# Altium schematic sheet Morpheus_middle.SchDoc: Morpheus_middle
size Letter; DrawnBy: D. Fusi; DocumentNumber: 2; Revision: DVT; SheetNumber: 2; SheetTotal: 7
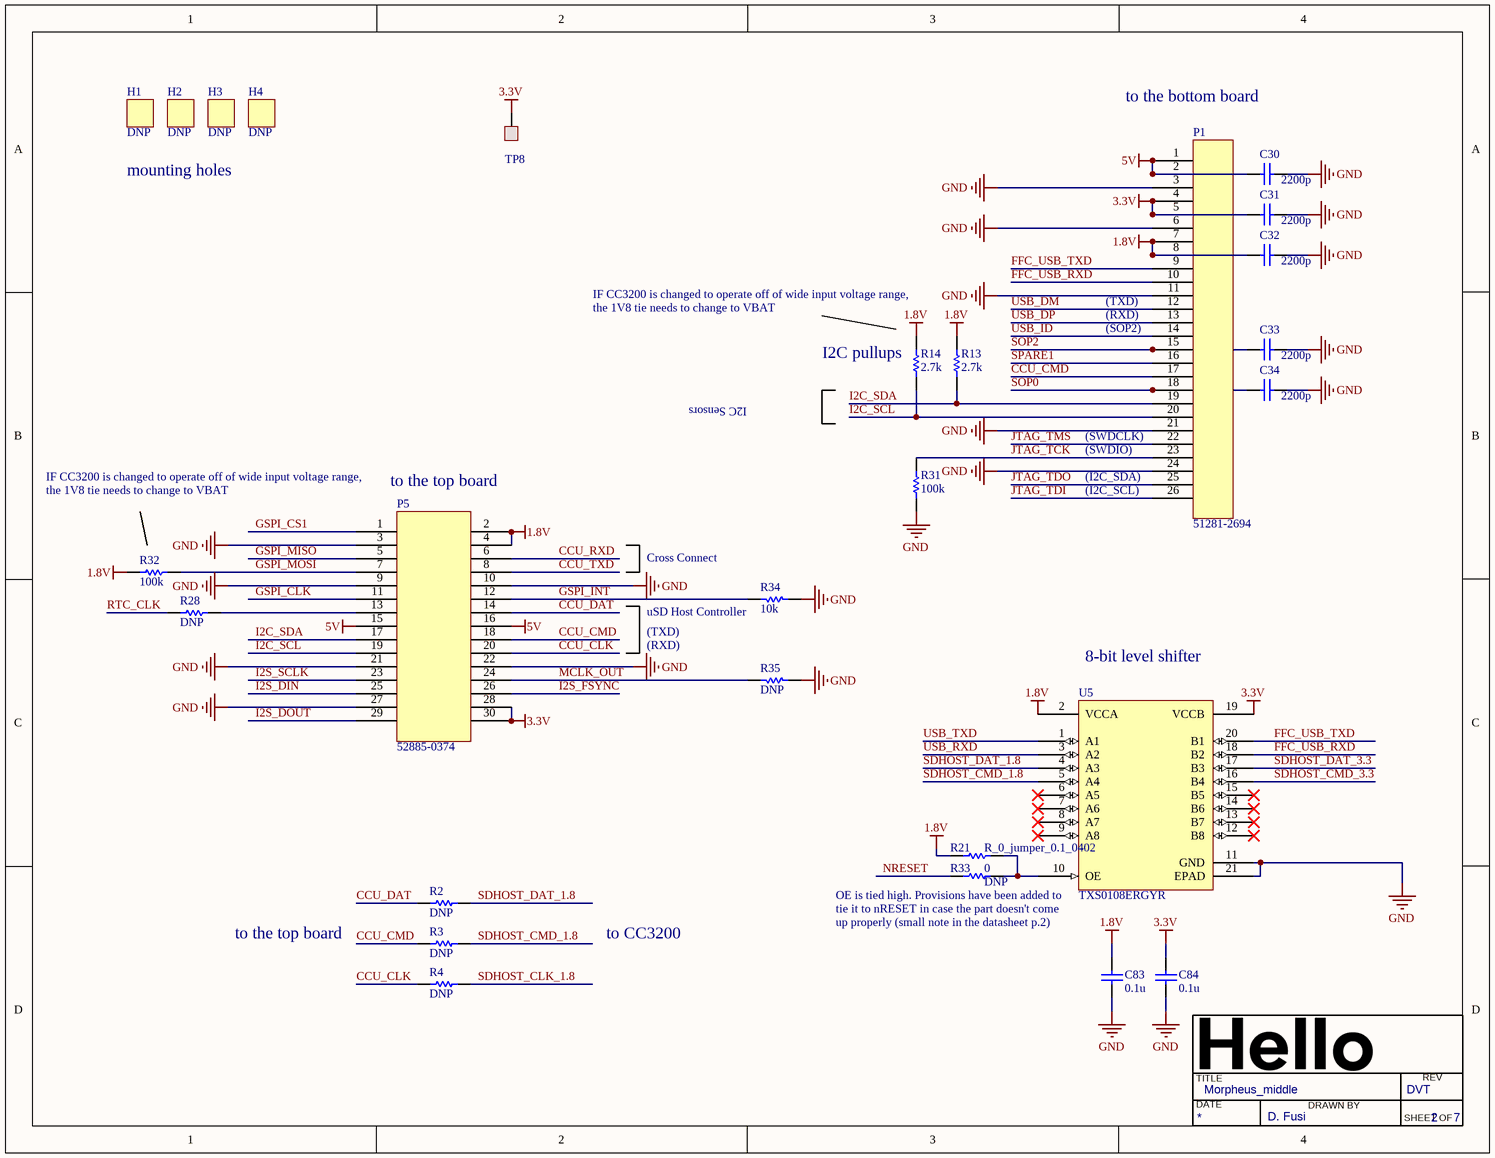
[diagram p0: Morpheus_middle.SchDoc]

## Parts
C30  2200p  [CAP0402_SENSE_DVT]
C31  2200p  [CAP0402_SENSE_DVT]
C32  2200p  [CAP0402_SENSE_DVT]
C33  2200p  [CAP0402_SENSE_DVT]
C34  2200p  [CAP0402_SENSE_DVT]
C83  0.1u  [CAP0402_SENSE_DVT]
C84  0.1u  [CAP0402_SENSE_DVT]
H1  DNP  [HOLE_ROUND_1.8mm]
H2  DNP  [HOLE_ROUND_1.8mm]
H3  DNP  [HOLE_ROUND_1.8mm]
H4  DNP  [HOLE_ROUND_1.8mm]
P1  51281-2694  [molex_51281-2694]
P5  52885-0374  [molex_52885-0374]
R2  DNP  [RES0402-SENSE-DVT]
R3  DNP  [RES0402-SENSE-DVT]
R4  DNP  [RES0402-SENSE-DVT]
R13  2.7k  [RES0402_SENSE_DVT]
R14  2.7k  [RES0402_SENSE_DVT]
R21  R_0_jumper_0.1_0402  [RES0402-SENSE-DVT]
R28  DNP  [RES0402-SENSE-DVT]
R31  100k  [RES0402_SENSE_DVT]
R32  100k  [RES0402_SENSE_DVT]
R33  DNP  value 0  [RES0402-SENSE-DVT]
R34  10k  [RES0402_SENSE_DVT]
R35  DNP  [RES0402_SENSE_DVT]
TP8  TP  [TP-1.1]  (value not drawn)
U5  TXS0108ERGYR  [QFN50P450X350X100_HS-21N]

## Nets
1.8V: C32.1 C83.2 P1.7 P1.8 P5.2 P5.4 R13.2 R14.2 R21.1 R32.2 U5.2(VCCA)
3.3V: C31.1 C84.2 P1.4 P1.5 P5.28 P5.30 TP8.1 U5.19(VCCB)
5V: C30.1 P1.1 P1.2 P5.15 P5.16
GND: C30.2 C31.2 C32.2 C33.2 C34.2 C83.1 C84.1 P1.3 P1.6 P1.11 P1.21 P1.24 P5.3 P5.9 P5.10 P5.21 P5.22 P5.27 R31.1 R34.2 R35.2 U5.11(GND) U5.21(EPAD)
CCU_CLK: P5.20 R4.1
CCU_CMD: P1.17 P5.18 R3.1
CCU_DAT: P5.14 R2.1
CCU_RXD: P5.6
CCU_TXD: P5.8
FFC_USB_RXD: P1.10 U5.18(B2)
FFC_USB_TXD: P1.9 U5.20(B1)
GSPI_CLK: P5.11
GSPI_CS1: P5.1
GSPI_INT: P5.12 R34.1
GSPI_MISO: P5.5
GSPI_MOSI: P5.7 R32.1
I2C_SCL: P1.20 P5.19 R14.1
I2C_SDA: P1.19 P5.17 R13.1
I2S_DIN: P5.25
I2S_DOUT: P5.29
I2S_FSYNC: P5.26
I2S_SCLK: P5.23
JTAG_TCK: P1.23 R31.2
JTAG_TDI: P1.26
JTAG_TDO: P1.25
JTAG_TMS: P1.22
MCLK_OUT: P5.24 R35.1
NRESET: R33.1
RTC_CLK: R28.1
SDHOST_CLK_1.8: R4.2
SDHOST_CMD_1.8: R3.2 U5.5(A4)
SDHOST_CMD_3.3: U5.16(B4)
SDHOST_DAT_1.8: R2.2 U5.4(A3)
SDHOST_DAT_3.3: U5.17(B3)
SOP0: C34.1 P1.18
SOP2: C33.1 P1.15
SPARE1: P1.16
USB_DM: P1.12
USB_DP: P1.13
USB_ID: P1.14
USB_RXD: U5.3(A2)
USB_TXD: U5.1(A1)
NetP5_13: P5.13 R28.2
NetR21_2: R21.2 R33.2 U5.10(OE)

Not connected (* = marked no-connect by the designer): U5 6(A5)* 7(A6)* 8(A7)* 9(A8)* 12(B8)* 13(B7)* 14(B6)* 15(B5)*

## Notes on the sheet
- to the bottom board
- mounting holes
- IF CC3200 is changed to operate off of wide input voltage range,
- the 1V8 tie needs to change to VBAT
- (near R14) I2C pullups
- (TXD)
- (RXD)
- (near P1) (SOP2)
- I2C Sensors
- (near P5) IF CC3200 is changed to operate off of wide input voltage range,
- (near P5) to the top board
- (SWDCLK)
- (SWDIO)
- (near P1) (I2C_SCL)
- (near P1) (I2C_SDA)
- (near R34) Cross Connect
- (near R34) uSD Host Controller
- (near U5) 8-bit level shifter
- OE is tied high. Provisions have been added to
- tie it to nRESET in case the part doesn't come
- to the top board
- to CC3200
- up properly (small note in the datasheet p.2)
- TITLE
- DATE
- DRAWN BY
- REV
- SHEET
- OF

## Library data of the parts
C30-C34 = C_2200p_5_16_STD_0402: Chip capacitor; Vendor: Taiyo Yuden; PN: EMK105SD222JV-F; Tolerance: 5 %; Voltage: 16V; Temp: Standard; Hello_PN: 225-00417; Value: 2200p; Size: 0402; item_category: Capacitor
C83 C84 = C_0.1u_10_50_X7R_0402: Chip capacitor; Vendor: Taiyo Yuden; PN: UMK105B7104KV-FR; Tolerance: 10%; Voltage: 50V; Temp: X7R; Hello_PN: 225-00468; Value: 0.1u; Size: 0402; item_category: Capacitor
H1-H4 = Hole: general purpose hole
P1 = molex_51281-2694: Molex 26-pin 0.5mm pitch connector; Hello_PN: 280-00202; PN: 51281-2694; Vendor: Molex; item_category: Connector
P5 = molex_52885-0374: Molex 30-pin 0.635mm pitch receptacle connector; Hello_PN: 280-00241; PN: 52885-0374; Vendor: Molex; item_category: Connector
R2-R4 R21 R28 = R_0_jumper_0.1_0402: Chip Resistor; Value: 0; Vendor: Panasonic; Tolerance: Jumper; Power: 0.1 W; PN: ERJ-2GE0R00X; Hello_PN: 220-00408; Model: *; Size: 0402; item_category: Resistor
R13 R14 = R_2.7k_5_0.1_0402: Chip Resistor; Vendor: Panasonic; Tolerance: 5 %; Power: 0.1 W; PN: ERJ-2GEJ272X; Hello_PN: 220-00248; Model: *; Value: 2.7k; Size: 0402
R31 R32 = R_100k_1_0.1_0402: Chip Resistor; Vendor: Panasonic; Tolerance: 1 %; Power: 0.1 W; PN: ERJ-2RKF1003X; Hello_PN: 220-00403; Model: *; Value: 100k; Size: 0402; item_category: Resistor
R33 = R_0_jumper_0.1_0402: Chip Resistor; Vendor: Panasonic; Tolerance: Jumper; Power: 0.1 W; PN: ERJ-2GE0R00X; Hello_PN: 220-00408; Model: *; Size: 0402; item_category: Resistor
R34 = R_10k_5_0.1_0402: Chip Resistor; Vendor: Panasonic; Tolerance: 5 %; Power: 0.1 W; PN: ERJ-2GEJ103X; Hello_PN: 220-00409; Model: *; Value: 10k; Size: 0402; item_category: Resistor
R35 = R_10k_5_0.1_0402: Chip Resistor; Value: 10k; Vendor: Panasonic; Tolerance: 5 %; Power: 0.1 W; PN: ERJ-2GEJ103X; Hello_PN: 220-00409; Model: *; Size: 0402; item_category: Resistor
TP8 = TP: testpoint
U5 = TXS0108ERGYR: 8-BIT BIDIRECTIONAL VOLTAGE-LEVEL TRANSLATOR  FOR OPEN-DRAIN AND PUSH-PULL APPLICATIONS; Vendor: TI; Hello_PN: 255-00354; item_category: IC_Digital; PN: TXS0108ERGYR